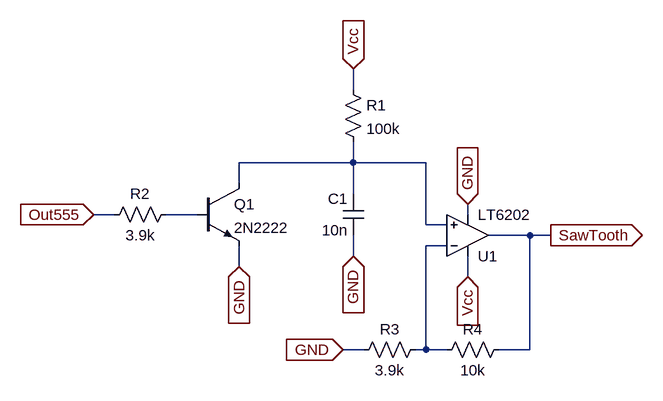
[diagram p0: schematic Mod4_SawTooth.asc]
Mod4_SawTooth.asc, the LTspice schematic file:
Version 4.1
SHEET 1 880 680
WIRE 256 16 256 -16
WIRE 256 128 256 96
WIRE 256 128 80 128
WIRE 368 128 256 128
WIRE 80 160 80 128
WIRE 256 176 256 128
WIRE -112 208 -144 208
WIRE 16 208 -32 208
WIRE 432 208 432 192
WIRE 368 224 368 128
WIRE 400 224 368 224
WIRE 528 240 464 240
WIRE 560 240 528 240
WIRE 400 256 368 256
WIRE 256 272 256 240
WIRE 80 288 80 256
WIRE 432 304 432 272
WIRE 272 416 240 416
WIRE 368 416 368 256
WIRE 368 416 352 416
WIRE 400 416 368 416
WIRE 528 416 528 240
WIRE 528 416 480 416
FLAG 256 -16 Vcc
IOPIN 256 -16 In
FLAG -144 208 Out555
IOPIN -144 208 In
FLAG 432 304 Vcc
IOPIN 432 304 In
FLAG 560 240 SawTooth
IOPIN 560 240 Out
FLAG 80 288 GND
IOPIN 80 288 In
FLAG 256 272 GND
IOPIN 256 272 In
FLAG 240 416 GND
IOPIN 240 416 In
FLAG 432 192 GND
IOPIN 432 192 In
SYMBOL npn 16 160 R0
SYMATTR InstName Q1
SYMATTR Value 2N2222
SYMBOL OpAmps\\LT6202 432 240 M180
SYMATTR InstName U1
SYMBOL cap 272 240 R180
WINDOW 0 24 56 Left 2
WINDOW 3 24 8 Left 2
SYMATTR InstName C1
SYMATTR Value 10n
SYMBOL res 240 0 R0
SYMATTR InstName R1
SYMATTR Value 100k
SYMBOL res -16 192 R90
WINDOW 0 0 56 VBottom 2
WINDOW 3 32 56 VTop 2
SYMATTR InstName R2
SYMATTR Value 3.9k
SYMBOL res 368 400 R90
WINDOW 0 0 56 VBottom 2
WINDOW 3 32 56 VTop 2
SYMATTR InstName R3
SYMATTR Value 3.9k
SYMBOL res 496 400 R90
WINDOW 0 0 56 VBottom 2
WINDOW 3 32 56 VTop 2
SYMATTR InstName R4
SYMATTR Value 10k

The netlist it stands for:
* Mod4_SawTooth.asc
Q1 N001 N002 GND 0 2N2222
* U1: LT6202 (symbol OpAmps\LT6202 not available, pins judged from their places): In+=N001 In-=N003 V+=Vcc V-=GND OUT=SawTooth
C1 GND N001 10n
R1 Vcc N001 100k
R2 N002 Out555 3.9k
R3 N003 GND 3.9k
R4 SawTooth N003 10k
.model NPN NPN
.model PNP PNP
.lib standard.bjt
.backanno
.end